# EAGLE design uav_router (EAGLE 6.4)
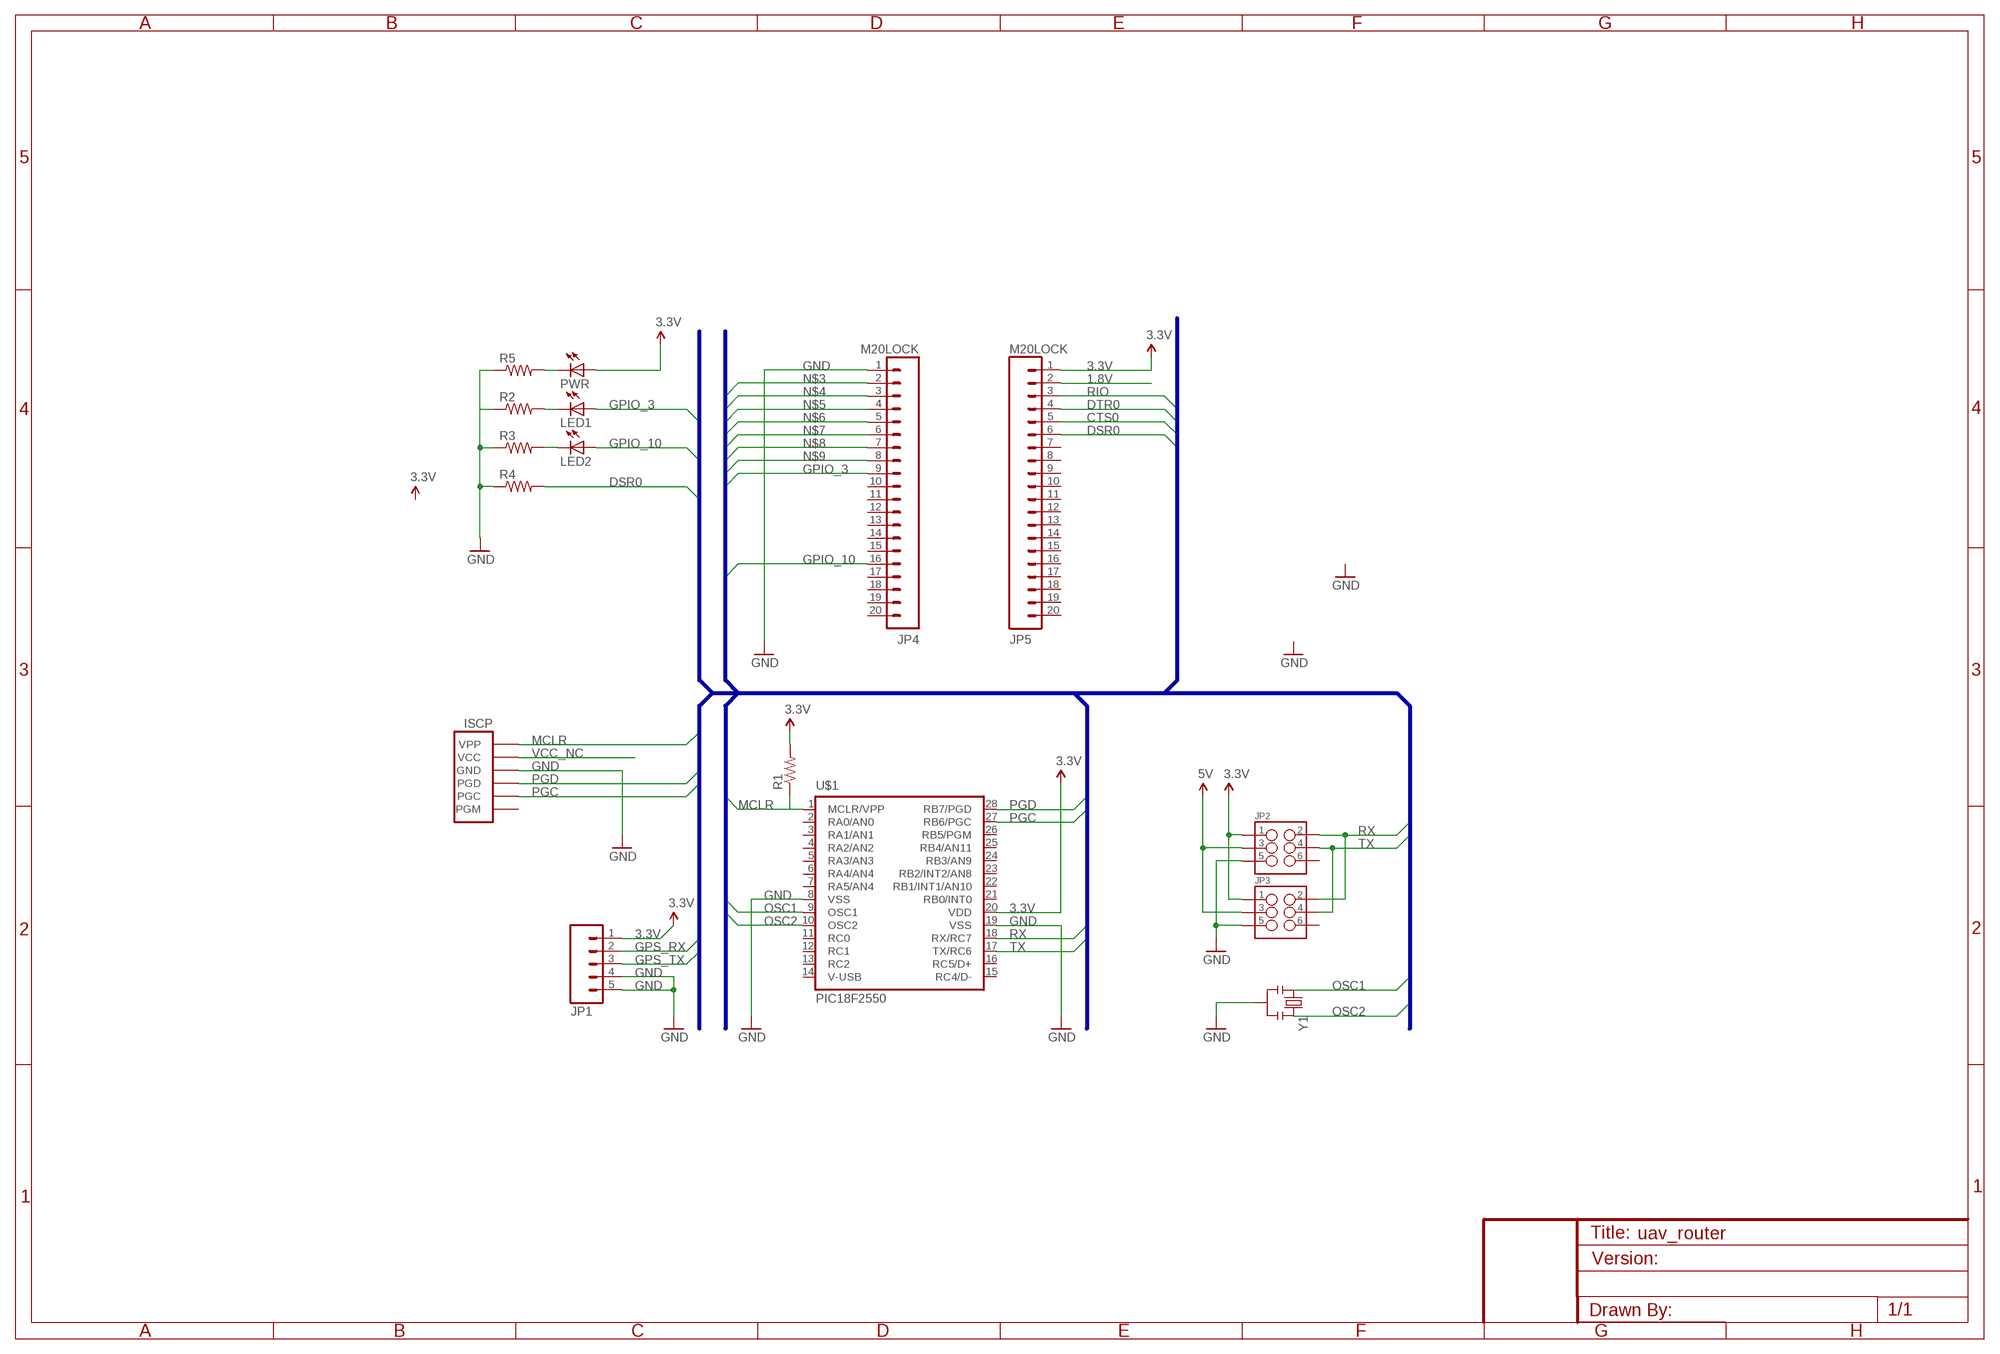
[diagram p0: schematic, sheet 1]

## Parts
ISCP  PIC-ICSPPOLAR_LOCK  [MOLEX-1X6_LOCK]
JP1  M05LOCK  [1X05_LOCK]
JP2  M03X2  [2X3-SHROUDED]
JP3  M03X2  [2X3-SHROUDED]
JP4  M20LOCK  [1X20_LOCK]
JP5  M20LOCK  [1X20_LOCK]
LED1  LED5MM  [LED5MM]
LED2  LED5MM  [LED5MM]
PWR  LED5MM  [LED5MM]
R1  RESISTORKIT  [AXIAL-0.3-KIT]
R2  RESISTORKIT  [AXIAL-0.3-KIT]
R3  RESISTORKIT  [AXIAL-0.3-KIT]
R4  RESISTORKIT  [AXIAL-0.3-KIT]
R5  RESISTORKIT  [AXIAL-0.3-KIT]
U$1  PIC18F2550  [DIL28-3]
Y1  RESONATORPTH  [RESONATOR-PTH]

## Nets
1.8V: JP5.2
3.3V: JP1.1 JP2.1 JP3.1 JP5.1 PWR.A R1.P$2 U$1.20(VDD)
5V: JP2.3 JP3.3
CTS0: JP5.5
DSR0: JP5.6 R4.P$2
DTR0: JP5.4
GND: ISCP.4(GND) JP1.4 JP1.5 JP2.5 JP3.5 JP4.1 R2.P$1 R3.P$1 R4.P$1 R5.P$1 U$1.8(VSS) U$1.19(VSS) Y1.2
GPIO_3: JP4.9 LED1.A
GPIO_10: JP4.16 LED2.A
GPS_RX: JP1.2
GPS_TX: JP1.3
MCLR: ISCP.6(VPP) R1.P$1 U$1.1(MCLR/VPP)
N$2: LED1.K(C) R2.P$2
N$3: JP4.2
N$4: JP4.3
N$5: JP4.4
N$6: JP4.5
N$7: JP4.6
N$8: JP4.7
N$9: JP4.8
N$10: LED2.K(C) R3.P$2
N$11: PWR.K(C) R5.P$2
OSC1: U$1.9(OSC1) Y1.1
OSC2: U$1.10(OSC2) Y1.3
PGC: ISCP.2(PGC) U$1.27(RB6/PGC)
PGD: ISCP.3(PGD) U$1.28(RB7/PGD)
RIO: JP5.3
RX: JP2.2 JP3.2 U$1.18(RX/RC7)
TX: JP2.4 JP3.4 U$1.17(TX/RC6)
VCC_NC: ISCP.5(VCC)
Unconnected: ISCP.1(PGM) JP2.6 JP3.6 JP4.10 JP4.11 JP4.12 JP4.13 JP4.14 JP4.15 JP4.17 JP4.18 JP4.19 JP4.20 JP5.7 JP5.8 JP5.9 JP5.10 JP5.11 JP5.12 JP5.13 JP5.14 JP5.15 JP5.16 JP5.17 JP5.18 JP5.19 JP5.20 U$1.2(RA0/AN0) U$1.3(RA1/AN1) U$1.4(RA2/AN2) U$1.5(RA3/AN3) U$1.6(RA4/AN4) U$1.7(RA5/AN4) U$1.11(RC0) U$1.12(RC1) U$1.13(RC2) U$1.14(V-USB) U$1.15(RC4/D-) U$1.16(RC5/D+) U$1.21(RB0/INT0) U$1.22(RB1/INT1/AN10) U$1.23(RB2/INT2/AN8) U$1.24(RB3/AN9) U$1.25(RB4/AN11) U$1.26(RB5/PGM)

## Buses
B$1

## Library data of the parts
ISCP = SparkFun-Connectors:PIC-ICSP: ISCP Programming connector for UAV, UBW Kit, etc.
JP1 = SparkFun-Connectors:M05: Header 5 Standard 5-pin 0.1" header. Use with straight break away headers (SKU : PRT-00116), right angle break away headers (PRT-00553), swiss pins (PRT-00743), machine pins (PRT-00117), and female headers (PRT-00115). Molex polarized connector foot print use with SKU : PRT-08230 with associated crimp pins and housings.
JP2 JP3 = SparkFun-Connectors:M03X2: 2x3 .1" header. Shrouded, with keying- CONN-10681 SMT- CONN-11415 Pogo pins- HW-11044; PROD_ID: CONN-10681
JP4 JP5 = SparkFun-Connectors:M20: 1x20 .1" header This is just like the LOCK variant in that the holes are staggared by 5 mil, but except for the last two holes. They are not altered from the "standard" footprint layout. This is used for a special purpose on the layout of our Graphic LCD Backpack. Make sure you want to use this device before selecting it for you project!
LED1 LED2 PWR = SparkFun-LED:LED: LEDs Standard schematic elements and footprints for 5mm, 3mm, 1206, and 0603 sized LEDs. 5mm - Spark Fun Electronics SKU : COM-00529 (and others)
R1-R5 = SparkFun-Resistors:RESISTOR: Resistor Basic schematic elements and footprints for 0603, 1206, and PTH resistors.
U$1 = SparkFun-DigitalIC:PIC18F2550
Y1 = SparkFun-FreqCtrl:RESONATOR: Resonator Small SMD resonator. Used, eg, on the Arduino Pro/ Pro Mini boards. 8MHz- XTAL-08895 16MHz- XTAL-08900

## Board
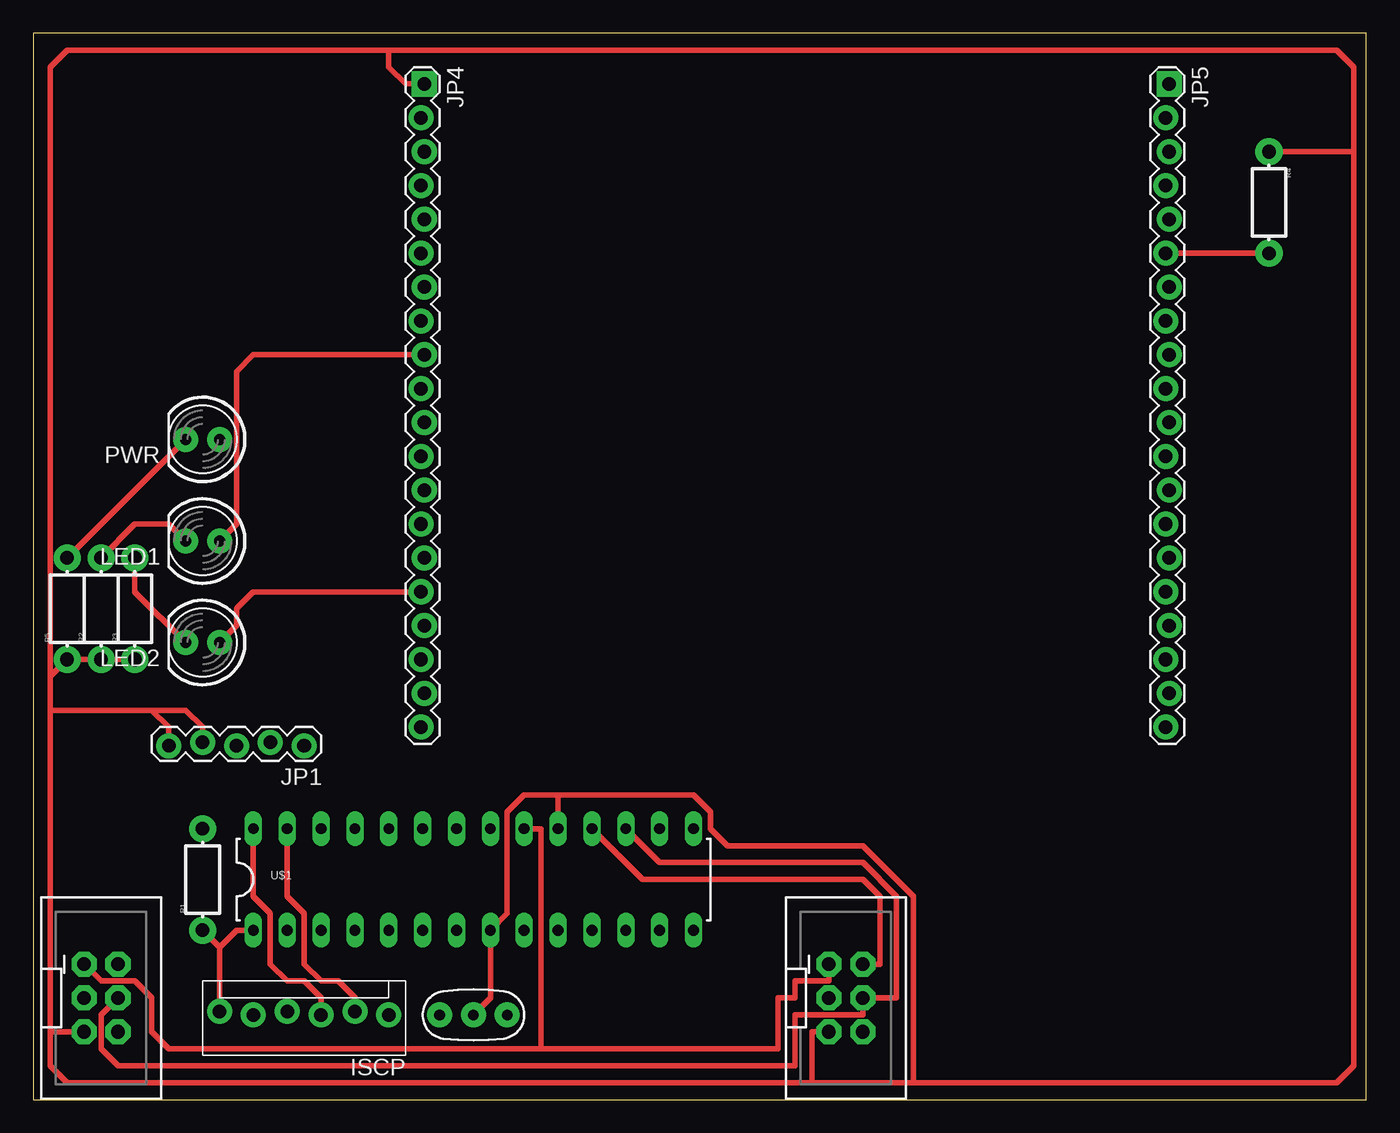
[diagram p1: board, top side]
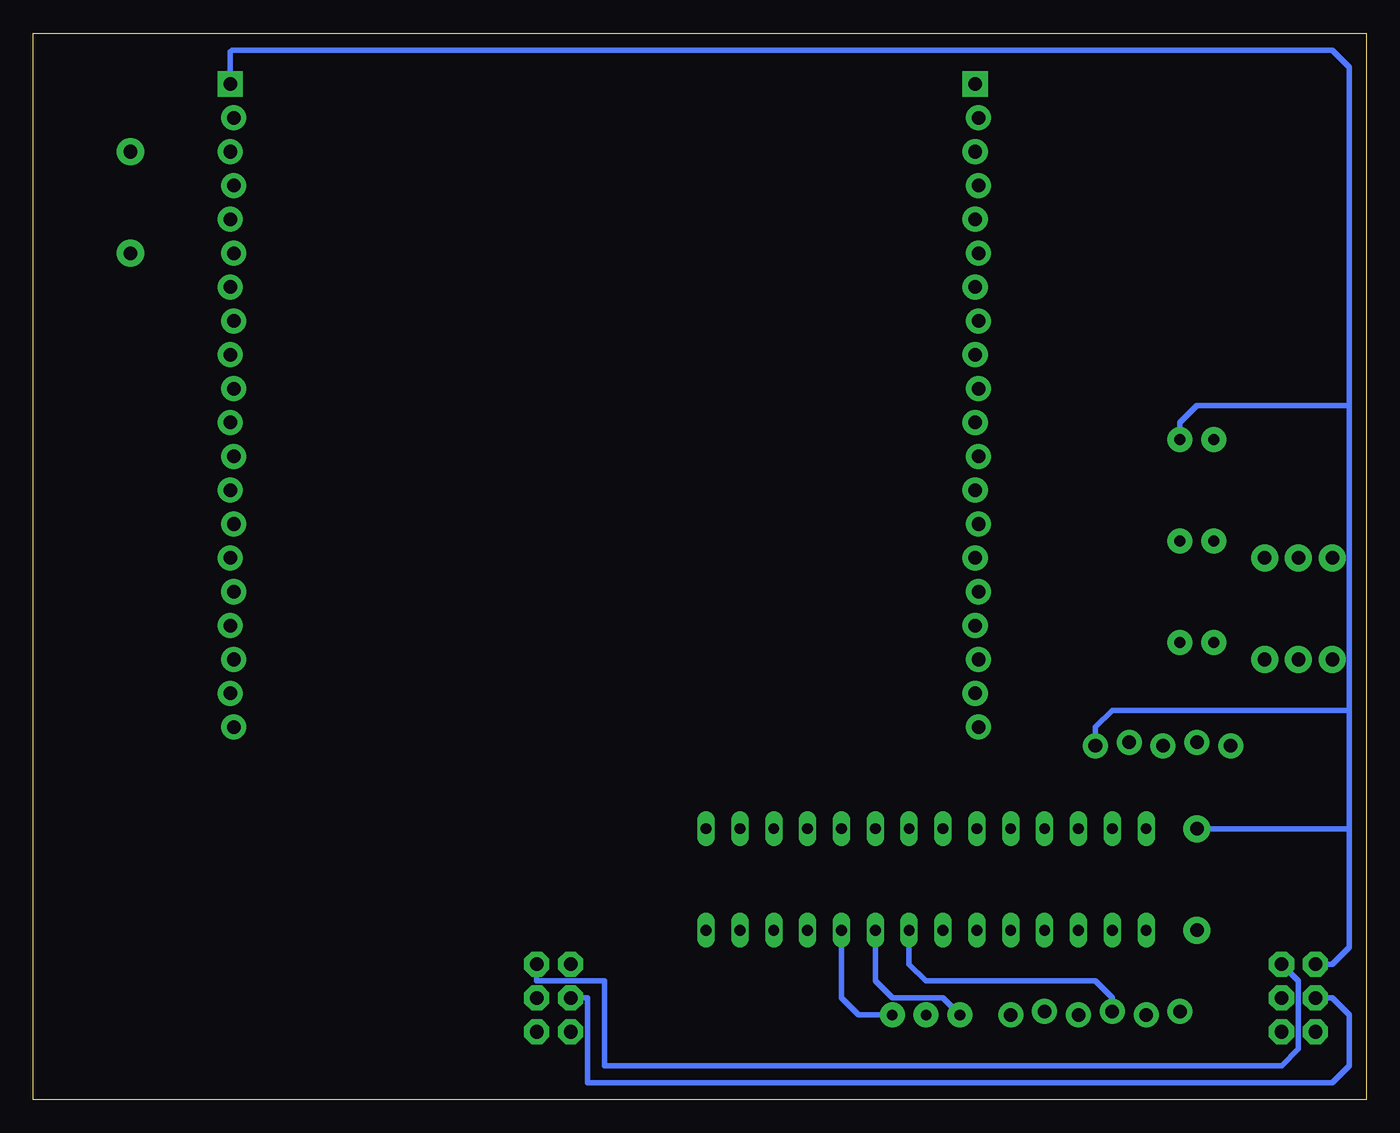
[diagram p2: board, bottom side, seen from below]

Size 100 x 80 mm. Coordinates in mm from the lower left corner, seen from the top.
Outline: 0,0 100,0 100,80 0,80 0,0
Copper layers (1*16): Top 0.035mm / dielectric 1.5mm / Bottom 0.035mm
Design rules "default": minimum track width 10mil, minimum drill 24mil, track to track 8mil, track to pad 8mil, pad to pad 8mil, via to via 8mil, smd to smd 8mil, copper to edge 40mil, drill to drill 8mil, minimum pad ring 10mil, minimum via ring 8mil, stop-mask expansion 4mil, vias tented up to drill 0mil, thermal gap 10mil

### Footprints (pad centres in the part's own frame; a part is rotated, then mirrored left to right if it is on the bottom)
MOLEX-1X6_LOCK = drill 1.016 pad 1.88: 1 0,0; 2 2.54,-0.254; 3 5.08,0; 4 7.62,-0.254; 5 10.16,0; 6 12.7,-0.254
1X05_LOCK = drill 1.016 pad 1.88: 1 0,0.127; 2 2.54,-0.127; 3 5.08,0.127; 4 7.62,-0.127; 5 10.16,0.127
2X3-SHROUDED = drill 1.016 pad 1.88 octagon: 1 -1.27,2.54; 2 1.27,2.54; 3 -1.27,0; 4 1.27,0; 5 -1.27,-2.54; 6 1.27,-2.54
1X20_LOCK = drill 1.016 pad 1.88 square: 1 0,0.127 | drill 1.016 pad 1.88: 2 2.54,-0.127; 3 5.08,0.127; 4 7.62,-0.127; 5 10.16,0.127; 6 12.7,-0.127; 7 15.24,0.127; 8 17.78,-0.127; 9 20.32,0.127; 10 22.86,-0.127; 11 25.4,0.127; 12 27.94,-0.127; 13 30.48,0.127; 14 33.02,-0.127; 15 35.56,0.127; 16 38.1,-0.127; 17 40.64,0.127; 18 43.18,-0.127; 19 45.72,0.127; 20 48.26,-0.127
LED5MM = drill 0.813 pad 1.88: A -1.27,0; K 1.27,0
AXIAL-0.3-KIT = drill 1.016 pad 2.032: P$1 -3.81,0; P$2 3.81,0
DIL28-3 = drill 0.813 long: 1 -16.51,-3.81; 2 -13.97,-3.81; 3 -11.43,-3.81; 4 -8.89,-3.81; 5 -6.35,-3.81; 6 -3.81,-3.81; 7 -1.27,-3.81; 8 1.27,-3.81; 9 3.81,-3.81; 10 6.35,-3.81; 11 8.89,-3.81; 12 11.43,-3.81; 13 13.97,-3.81; 14 16.51,-3.81; 15 16.51,3.81; 16 13.97,3.81; 17 11.43,3.81; 18 8.89,3.81; 19 6.35,3.81; 20 3.81,3.81; 21 1.27,3.81; 22 -1.27,3.81; 23 -3.81,3.81; 24 -6.35,3.81; 25 -8.89,3.81; 26 -11.43,3.81; 27 -13.97,3.81; 28 -16.51,3.81
RESONATOR-PTH = drill 0.8 pad 1.88: 1 -2.54,0; 2 0,0; 3 2.54,0

### Placement (x,y rotation side)
ISCP  26.67,6.35 180 top
JP1  20.32,26.67 180 top
JP2  60.96,7.62 0 top
JP3  5.08,7.62 0 top
JP4  29.21,76.2 270 top
JP5  85.09,76.2 270 top
LED1  12.7,41.91 180 top
LED2  12.7,34.29 180 top
PWR  12.7,49.53 180 top
R1  12.7,16.51 90 top
R2  5.08,36.83 90 top
R3  7.62,36.83 90 top
R4  92.71,67.31 270 top
R5  2.54,36.83 90 top
U$1  33.02,16.51 0 top
Y1  33.02,6.35 0 top

### Tracks (layer width: path | path; a pad name or v marks a point on that pad's centre or on a via)
3.3V
  Top 0.406: JP3.1 5.08,8.89 7.62,8.89 8.89,7.62 8.89,5.08 10.16,3.81 38.1,3.81 | 38.1,3.81 55.88,3.81 55.88,7.62 57.15,7.62 57.15,8.89 59.69,8.89 JP2.1 | U$1.20 38.1,20.32 38.1,3.81
  Bottom 0.406: PWR.A 13.97,50.8 12.7,52.07 1.27,52.07 | 1.27,52.07 1.27,29.21 | 1.27,29.21 1.27,20.32 | 1.27,20.32 1.27,11.43 2.54,10.16 JP3.1 | R1.P$2 1.27,20.32 | JP1.1 20.32,27.94 19.05,29.21 1.27,29.21 | JP5.1 85.22,78.61 85.09,78.74 2.54,78.74 1.27,77.47 1.27,52.07
5V
  Bottom 0.406: JP3.3 2.54,7.62 1.27,6.35 1.27,2.54 2.54,1.27 58.42,1.27 58.42,7.62 JP2.3
DSR0
  Top 0.406: R4.P$2 JP5.6
GND
  Top 0.406: JP3.5 1.27,5.08 | 1.27,5.08 1.27,2.54 2.54,1.27 58.42,1.27 | 58.42,1.27 58.42,5.08 JP2.5 | 1.27,29.21 1.27,5.08 | Y1.2 34.29,7.62 U$1.8 35.56,13.97 35.56,21.59 36.83,22.86 39.37,22.86 | 39.37,22.86 U$1.19 | 8.89,29.21 11.43,29.21 12.7,27.94 JP1.4 | 8.89,29.21 1.27,29.21 | JP1.5 10.16,27.94 8.89,29.21 | 1.27,29.21 1.27,31.75 | 1.27,31.75 R5.P$1 R2.P$1 R3.P$1 | 1.27,31.75 1.27,77.47 2.54,78.74 26.67,78.74 | 26.67,78.74 97.79,78.74 99.06,77.47 99.06,71.12 | 99.06,71.12 99.06,2.54 97.79,1.27 66.04,1.27 | 66.04,1.27 58.42,1.27 | R4.P$1 99.06,71.12 | JP4.1 27.94,76.2 26.67,77.47 26.67,78.74 | 39.37,22.86 49.53,22.86 50.8,21.59 50.8,20.32 52.07,19.05 62.23,19.05 66.04,15.24 66.04,1.27
  Bottom 0.406: ISCP.4 19.05,7.62 20.32,8.89 33.02,8.89 34.29,10.16 U$1.8
GPIO_3
  Top 0.406: LED1.A 15.24,43.18 15.24,54.61 16.51,55.88 JP4.9
GPIO_10
  Top 0.406: LED2.A 15.24,35.56 15.24,36.83 16.51,38.1 JP4.16
MCLR
  Top 0.406: ISCP.6 13.97,11.43 | 13.97,11.43 R1.P$1 | U$1.1 15.24,12.7 13.97,11.43
N$2
  Top 0.406: R2.P$2 7.62,43.18 10.16,43.18 LED1.K
N$10
  Top 0.406: R3.P$2 7.62,38.1 LED2.K
N$11
  Top 0.406: R5.P$2 PWR.K
OSC1
  Bottom 0.406: Y1.1 31.75,7.62 35.56,7.62 36.83,8.89 U$1.9
OSC2
  Bottom 0.406: Y1.3 38.1,6.35 39.37,7.62 U$1.10
PGC
  Top 0.406: U$1.27 19.05,15.24 20.32,13.97 20.32,10.16 21.59,8.89 22.86,8.89 24.13,7.62 ISCP.2
PGD
  Top 0.406: U$1.28 16.51,15.24 17.78,13.97 17.78,10.16 19.05,8.89 20.32,8.89 21.59,7.62 ISCP.3
RX
  Top 0.406: U$1.18 45.72,16.51 62.23,16.51 63.5,15.24 63.5,10.16 JP2.2
  Bottom 0.406: JP3.2 5.08,8.89 5.08,3.81 6.35,2.54 57.15,2.54 57.15,8.89 62.23,8.89 JP2.2
TX
  Top 0.406: JP3.4 5.08,6.35 5.08,3.81 6.35,2.54 57.15,2.54 57.15,6.35 62.23,6.35 JP2.4 64.77,7.62 64.77,15.24 62.23,17.78 46.99,17.78 U$1.17